# EAGLE schematic Dual_Power_Supply (EAGLE 9.6.2)
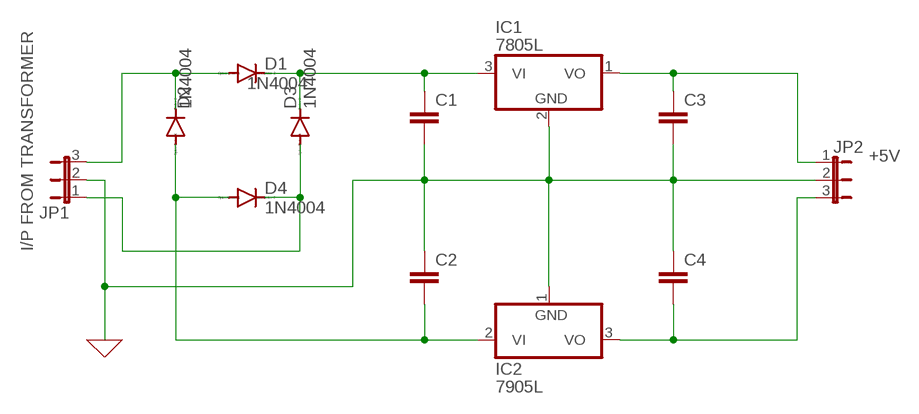
[diagram p0: schematic, sheet 1]

## Parts
C1  C2,5-3  [C2.5-3]
C2  C2,5-3  [C2.5-3]
C3  C2,5-3  [C2.5-3]
C4  C2,5-3  [C2.5-3]
D1  1N4004  [DO41-10]
D2  1N4004  [DO41-10]
D3  1N4004  [DO41-10]
D4  1N4004  [DO41-10]
IC1  7805L  [TO92]
IC3  7905L  [TO92]
JP1  JP2E  [JP2]
JP2  JP2E  [JP2]

## Nets
0: C1.2 C2.1 C3.2 C4.1 IC1.2(GND) IC3.1(GND) JP1.2 JP2.2 ; supply symbol labelled GND
N$1: D1.A D2.C JP1.3
N$2: C1.1 D1.C D3.C IC1.3(VI)
N$3: D3.A D4.C JP1.1
N$4: C2.2 D2.A D4.A IC3.2(VI)
N$5: C4.2 IC3.3(VO) JP2.3
N$6: C3.1 IC1.1(VO) JP2.1

## Notes on the sheet
- +5V
- I/P FROM TRANSFORMER
- IC2
- 7905L

## Library data of the parts
C1-C4 = capacitor-wima:C: CAPACITOR naming: grid - package width
D1-D4 = diode:1N4004: DIODE general purpose rectifier, 1 A
IC1 = linear:78*: Positive VOLTAGE REGULATOR Source: http://cache.national.com/ds/LM/LM78L05.pdf http://www.fairchildsemi.com/ds/LM/LM7805.pdf
IC3 = linear:79*: Negative VOLTAGE REGULATOR
JP1 JP2 = jumper:JP2E: JUMPER